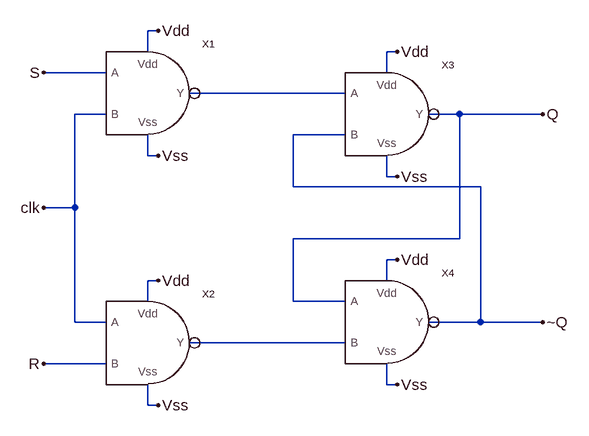
[diagram p0: schematic SR_FF_IC.asc]
SR_FF_IC.asc, the LTspice schematic file:
Version 4
SHEET 1 1500 980
WIRE 80 -64 64 -64
WIRE 64 -32 64 -64
WIRE 448 -32 432 -32
WIRE 0 0 -96 0
WIRE 432 0 432 -32
WIRE 368 32 128 32
WIRE 0 64 -48 64
WIRE 544 64 496 64
WIRE 672 64 544 64
WIRE 368 96 288 96
WIRE 64 128 64 96
WIRE 80 128 64 128
WIRE 432 160 432 128
WIRE 448 160 432 160
WIRE 288 176 288 96
WIRE 576 176 288 176
WIRE -48 208 -48 64
WIRE -48 208 -96 208
WIRE 544 256 544 64
WIRE 544 256 288 256
WIRE 448 288 432 288
WIRE 80 320 64 320
WIRE 432 320 432 288
WIRE 64 352 64 320
WIRE 288 352 288 256
WIRE 368 352 288 352
WIRE -48 384 -48 208
WIRE 0 384 -48 384
WIRE 576 384 576 176
WIRE 576 384 496 384
WIRE 672 384 576 384
WIRE 368 416 128 416
WIRE 0 448 -96 448
WIRE 432 480 432 448
WIRE 448 480 432 480
WIRE 64 512 64 480
WIRE 80 512 64 512
FLAG 80 -64 Vdd
FLAG 80 128 Vss
FLAG 448 -32 Vdd
FLAG 448 160 Vss
FLAG 80 512 Vss
FLAG 448 480 Vss
FLAG 448 288 Vdd
FLAG 80 320 Vdd
FLAG 672 64 Q
FLAG 672 384 ~Q
FLAG -96 0 S
FLAG -96 448 R
FLAG -96 208 clk
SYMBOL nand 64 48 R0
SYMATTR InstName X1
SYMBOL nand 64 432 R0
SYMATTR InstName X2
SYMBOL nand 432 80 R0
SYMATTR InstName X3
SYMBOL nand 432 400 R0
SYMATTR InstName X4

The netlist it stands for:
* SR_FF_IC.asc
XX1 S clk Vdd Vss N001 nand  ; pins A B Vdd Vss Y
XX2 clk R Vdd Vss N002 nand  ; pins A B Vdd Vss Y
XX3 N001 ~Q Vdd Vss Q nand  ; pins A B Vdd Vss Y
XX4 Q N002 Vdd Vss ~Q nand  ; pins A B Vdd Vss Y
.backanno
.end